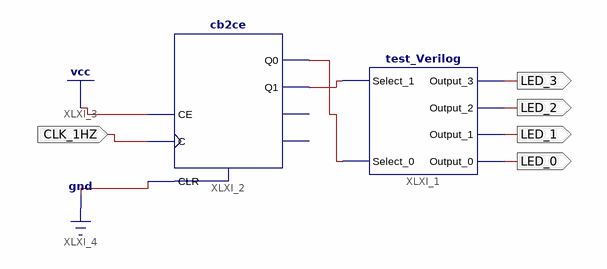
[diagram p0: schematic sheet 1]
// Xilinx ISE schematic add_test_Verilog.sch (xc9500) as structural Verilog: 2 symbols, 5 ports
module add_test_Verilog (
  input  CLK_1HZ,
  output LED_3,
  output LED_2,
  output LED_1,
  output LED_0
);

  wire XLXN_5, XLXN_6;

  test_Verilog XLXI_1 (
    .Select_1(XLXN_5), .Select_0(XLXN_6), .Output_3(LED_3), .Output_2(LED_2), .Output_1(LED_1),
    .Output_0(LED_0));
  cb2ce XLXI_2 (.C(CLK_1HZ), .CE(1'b1), .CLR(1'b0), .Q0(XLXN_6), .Q1(XLXN_5));  // open: CEO, TC
endmodule
